# EAGLE design astabil (EAGLE 6.5.0)
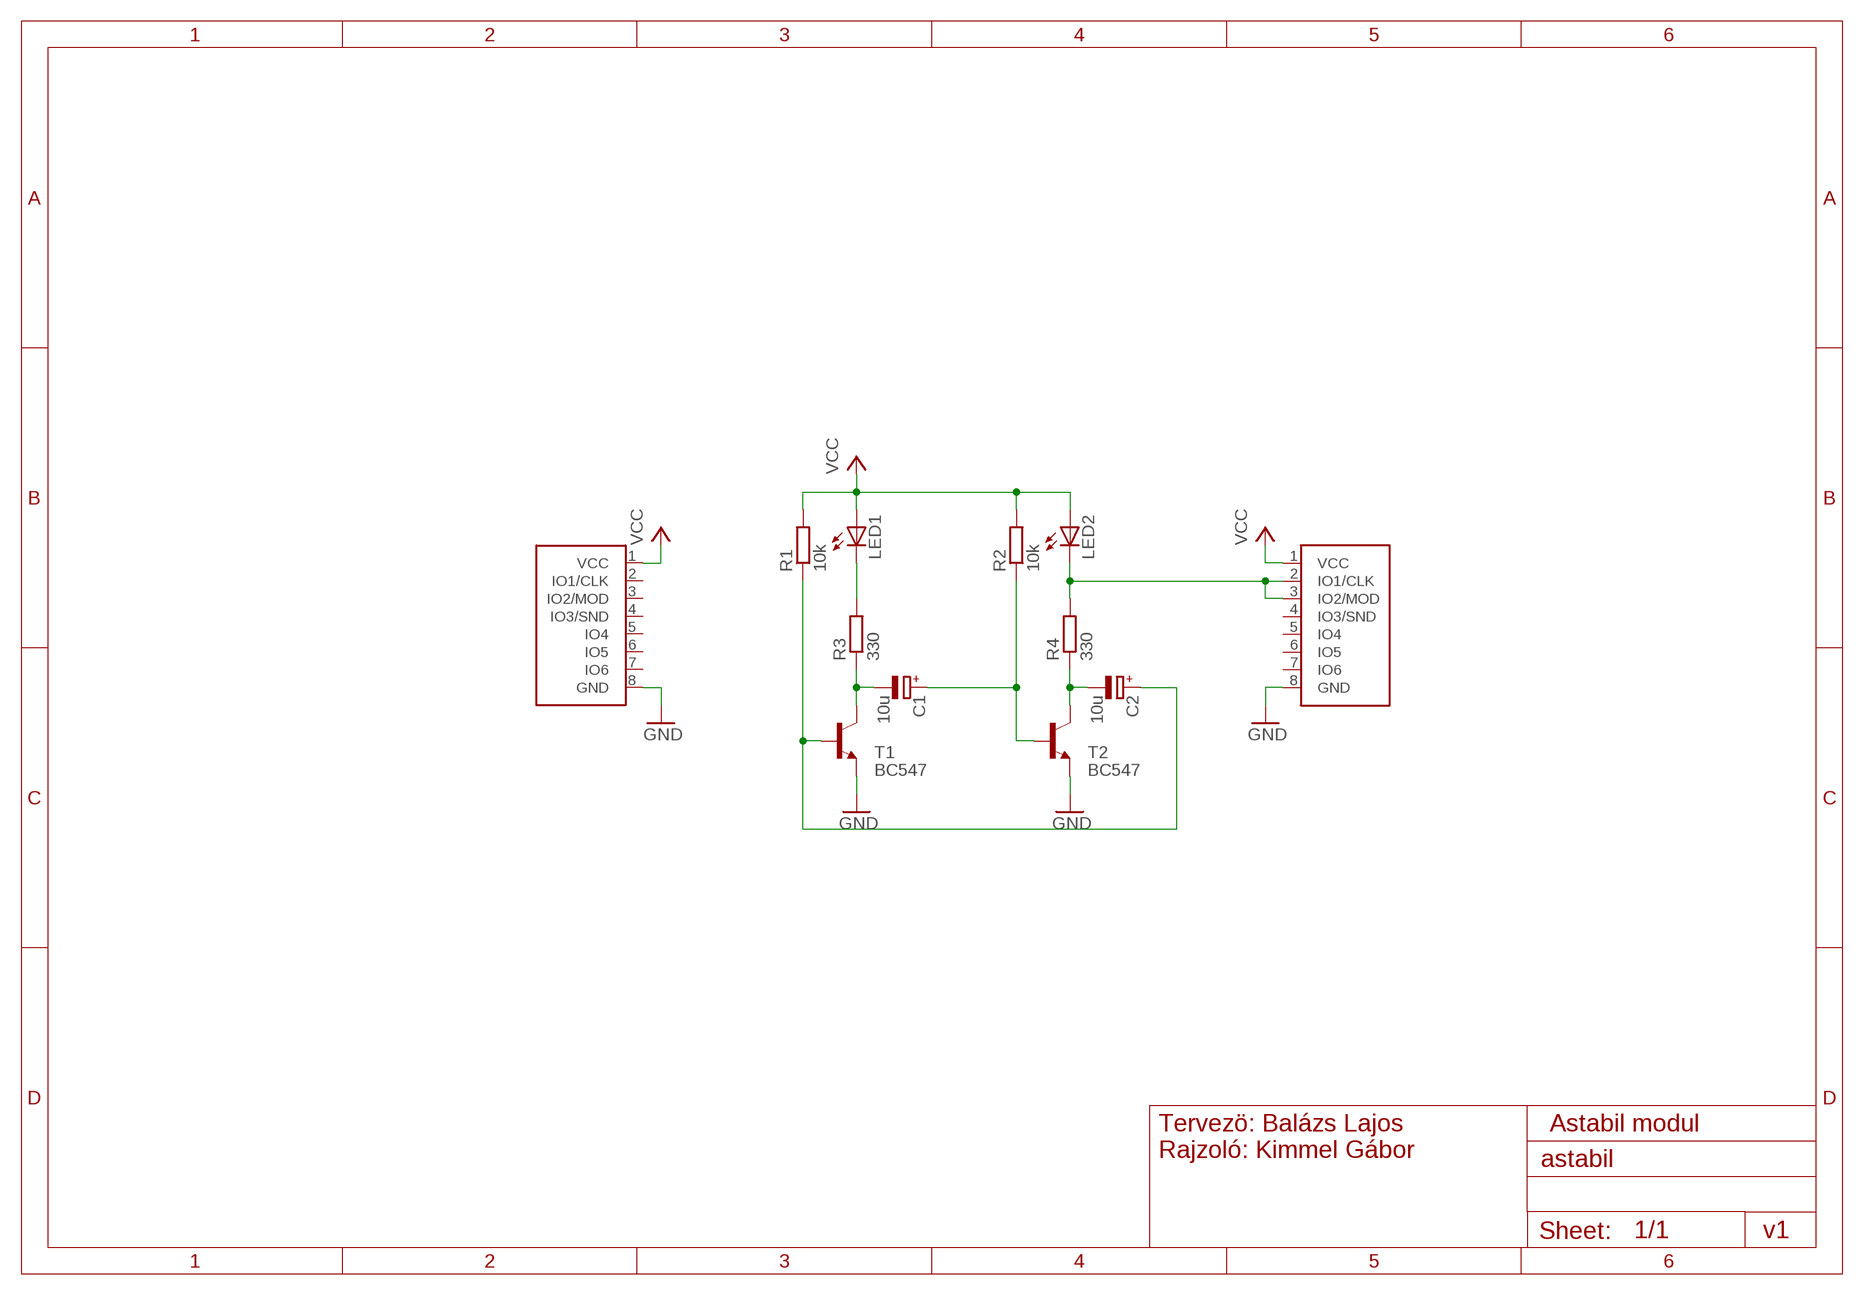
[diagram p0: schematic, sheet 1]

## Parts
C1  10u  CPOL-EUE3.5-8  [E3,5-8]
C2  10u  CPOL-EUE3.5-8  [E3,5-8]
LED1  LED5MM  [LED5MM]
LED2  LED5MM  [LED5MM]
R1  10k  R-EU_0207/10  [0207/10]
R2  10k  R-EU_0207/10  [0207/10]
R3  330  R-EU_0207/10  [0207/10]
R4  330  R-EU_0207/10  [0207/10]
T1  BC547  BC547-NPN-TO92-CBE  [TO92-CBE]
T2  BC547  BC547-NPN-TO92-CBE  [TO92-CBE]
U$1  GANZ-CONNECTOR  [FE08W]
U$2  GANZ-CONNECTOR-OUT  [MA08-1W]

## Nets
GND: T1.E T2.E U$1.8(GND) U$2.8(GND)
N$2: C2.+ R1.1 T1.B
N$3: C1.+ R2.1 T2.B
N$5: C1.- R3.1 T1.C
N$6: LED1.K(C) R3.2
N$7: C2.- R4.1 T2.C
N$8: LED2.K(C) R4.2 U$2.2(IO1/CLK) U$2.3(IO2/MOD)
VCC: LED1.A LED2.A R1.2 R2.2 U$1.1(VCC) U$2.1(VCC)
Unconnected: U$1.2(IO1/CLK) U$1.3(IO2/MOD) U$1.4(IO3/SND) U$1.5(IO4) U$1.6(IO5) U$1.7(IO6) U$2.4(IO3/SND) U$2.5(IO4) U$2.6(IO5) U$2.7(IO6)

## Notes on the sheet
- Tervezö: Balázs Lajos
  Rajzoló: Kimmel Gábor
- Astabil modul
- v1

## Library data of the parts
C1 C2 = resistor:CPOL-EU: POLARIZED CAPACITOR, European symbol
LED1 LED2 = led:LED: LED OSRAM: - CHIPLED LG R971, LG N971, LY N971, LG Q971, LY Q971, LO R971, LY R971 LH N974, LH R974 LS Q976, LO Q976, LY Q976 LO Q996 - Hyper CHIPLED LW Q18S LB Q993, LB Q99A, LB R99A - SideLED LS A670, LO A670, LY A670, LG A670, LP A670 LB A673, LV A673, LT A673, LW A673 LH A674 LY A675 LS A676, LA A676, LO A676, LY A676, LW A676 LS A679, LY A679, LG A679 - Hyper Micro SIDELED® LS Y876, LA Y876, LO Y876, LY Y876 LT Y87S - SmartLED LW L88C, LW L88S LB L89C, LB L89S, LG L890 LS L89K, LO L89K, LY L89K LS L896, LA L896, LO L896, LY L896 - TOPLED LS T670, LO T670, LY T670, LG T670, LP T670 LSG T670, LSP T670, LSY T670, LOP T670, LYG T670 LG T671, LOG T671, LSG T671 LB T673, LV T673, LT T673, LW T673 LH T674 LS T676, LA T676, LO T676, LY T676, LB T676, LH T676, LSB T676, LW T676 LB T67C, LV T67C, LT T67C, LS T67K, LO T67K, LY T67K, LW E67C LS E67B, LA E67B, LO E67B, LY E67B, LB E67C, LV E67C, LT E67C LW T67C LS T679, LY T679, LG T679 LS T770, LO T770, LY T770, LG T770, LP T770 LB T773, LV T773, LT T773, LW T773 LH T774 LS E675, LA E675, LY E675, LS T675 LS T776, LA T776, LO T776, LY T776, LB T776 LHGB T686 LT T68C, LB T68C - Hyper Mini TOPLED® LB M676 - Mini TOPLED Santana® LG M470 LS M47K, LO M47K, LY M47K Source: http://www.osram.convergy.de LUXEON: - LUMILED® LXK2-PW12-R00, LXK2-PW12-S00, LXK2-PW14-U00, LXK2-PW14-V00 LXK2-PM12-R00, LXK2-PM12-S00, LXK2-PM14-U00 LXK2-PE12-Q00, LXK2-PE12-R00, LXK2-PE12-S00, LXK2-PE14-T00, LXK2-PE14-U00 LXK2-PB12-K00, LXK2-PB12-L00, LXK2-PB12-M00, LXK2-PB14-N00, LXK2-PB14-P00, LXK2-PB14-Q00 LXK2-PR12-L00, LXK2-PR12-M00, LXK2-PR14-Q00, LXK2-PR14-R00 LXK2-PD12-Q00, LXK2-PD12-R00, LXK2-PD12-S00 LXK2-PH12-R00, LXK2-PH12-S00 LXK2-PL12-P00, LXK2-PL12-Q00, LXK2-PL12-R00 Source: www.luxeon.com KINGBRIGHT: KA-3528ASYC Source: www.kingbright.com
R1-R4 = resistor:R-EU_: RESISTOR, European symbol
T1 T2 = transistor:*-NPN-: NPN Transistror BF959 corrected 2008.03.06
U$1 = ganzlib:GANZ-CONNECTOR
U$2 = ganzlib:GANZ-CONNECTOR-OUT

## Board
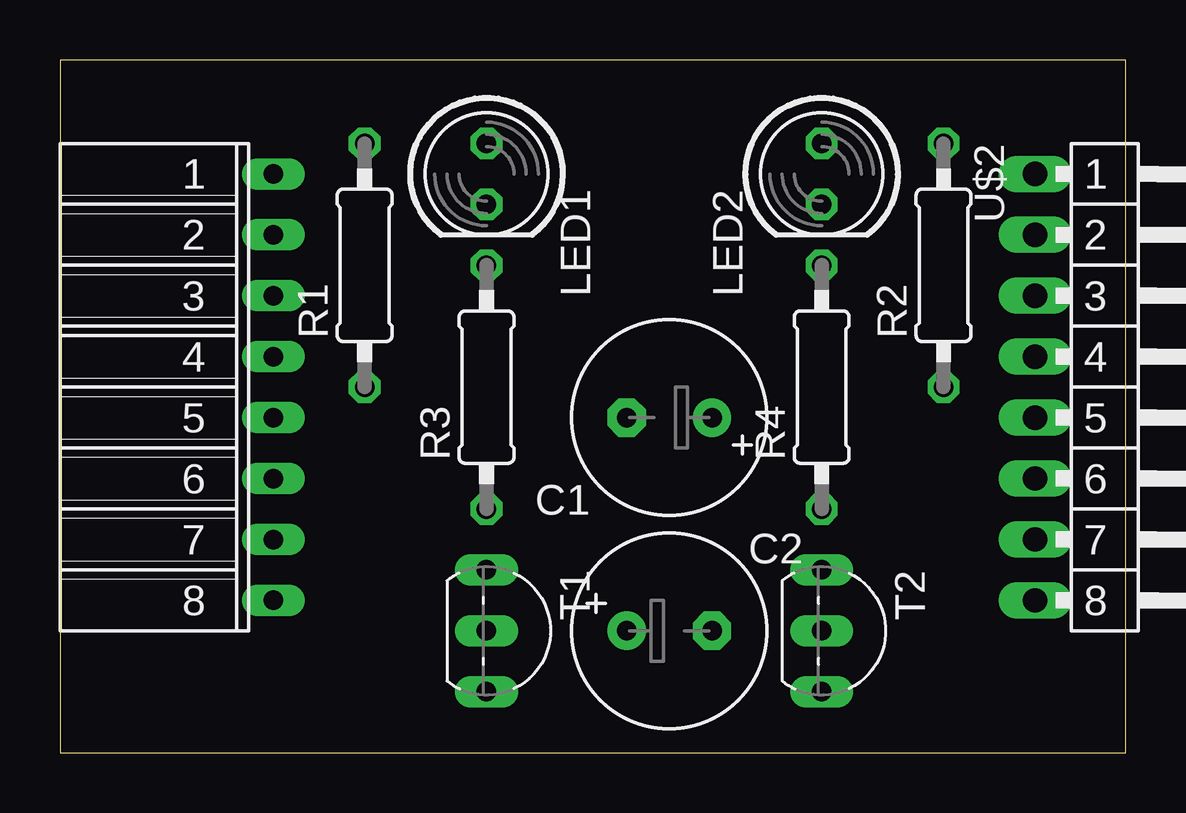
[diagram p1: board, top side]
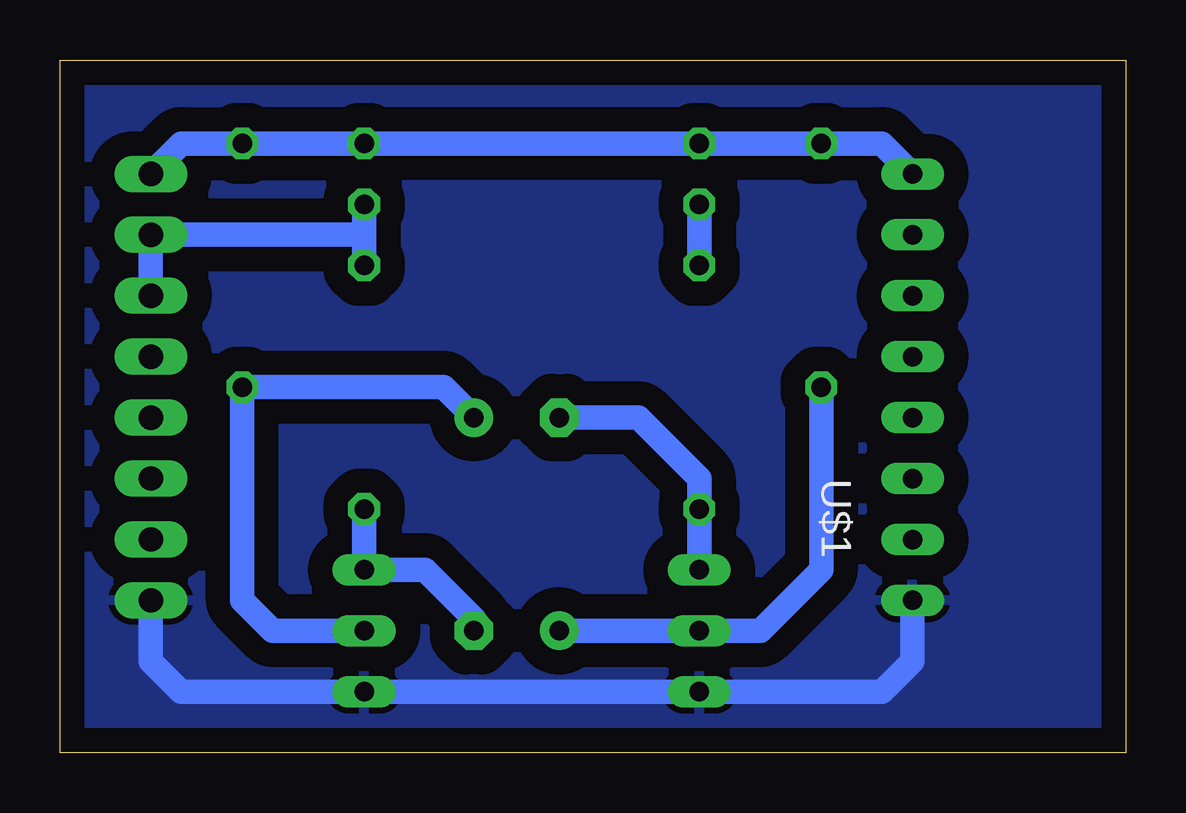
[diagram p2: board, bottom side, seen from below]

Size 44.43 x 28.88 mm. Coordinates in mm from the lower left corner, seen from the top.
Outline: 0,0 44.43,0 44.43,28.88 0,28.88 0,0
Copper layers (1*16): Top 0.035mm / dielectric 1.5mm / Bottom 0.035mm
Design rules "default *": minimum track width 10mil, minimum drill 24mil, track to track 8mil, track to pad 8mil, pad to pad 8mil, via to via 8mil, smd to smd 8mil, copper to edge 40mil, drill to drill 8mil, minimum pad ring 10mil, minimum via ring 8mil, stop-mask expansion 4mil, vias tented up to drill 0mil, thermal gap 10mil

### Footprints (pad centres in the part's own frame; a part is rotated, then mirrored left to right if it is on the bottom)
E3,5-8 = drill 0.813 pad 1.6: + -1.778,0 | drill 0.813 pad 1.6 octagon: - 1.778,0
LED5MM = drill 0.813 octagon: A -1.27,0; K 1.27,0
0207/10 = drill 0.813 octagon: 1 -5.08,0; 2 5.08,0
TO92-CBE = drill 0.813 long: B 0,0; C -2.54,0; E 2.54,0
FE08W = drill 0.813 long: 1 5.08,8.89; 2 5.08,6.35; 3 5.08,3.81; 4 5.08,1.27; 5 5.08,-1.27; 6 5.08,-3.81; 7 5.08,-6.35; 8 5.08,-8.89
MA08-1W = drill 1.016 long: 1 0,8.89; 2 0,6.35; 3 0,3.81; 4 0,1.27; 5 0,-1.27; 6 0,-3.81; 7 0,-6.35; 8 0,-8.89

### Placement (x,y rotation side)
C1  25.4,13.97 180 top
C2  25.4,5.08 0 top
LED1  17.78,24.13 270 top
LED2  31.75,24.13 270 top
R1  12.7,20.32 90 top
R2  36.83,20.32 90 top
R3  17.78,15.24 90 top
R4  31.75,15.24 90 top
T1  17.78,5.08 270 top
T2  31.75,5.08 270 top
U$1  3.81,15.24 0 top
U$2  40.64,15.24 0 top

### Tracks (layer width: path | path; a pad name or v marks a point on that pad's centre or on a via)
GND
  Bottom 1.016: U$1.8 8.89,3.81 10.16,2.54 T1.E T2.E 39.37,2.54 40.64,3.81 U$2.8
  pour Bottom (isolate 1.016): 0,29.21 44.45,29.21 44.45,0 0,0
N$2
  Bottom 1.016: R1.1 12.7,7.62 15.24,5.08 T1.B C2.+
N$3
  Bottom 1.016: C1.+ 28.45,15.24 R2.1 36.83,6.35 35.56,5.08 T2.B
N$5
  Bottom 1.016: T1.C R3.1 17.78,11.43 20.32,13.97 C1.-
N$6
  Bottom 1.016: LED1.K R3.2
N$7
  Bottom 1.016: R4.1 T2.C 29.21,7.62 27.18,5.59 C2.-
N$8
  Bottom 1.016: LED2.K 31.75,21.59 | 31.75,21.59 R4.2 | U$2.3 U$2.2 31.75,21.59
VCC
  Bottom 1.016: R2.2 LED1.A R1.2 10.16,25.4 U$1.1 | R2.2 LED2.A | U$2.1 39.37,25.4 R2.2